# EAGLE schematic board 1 (EAGLE 7.2.0)
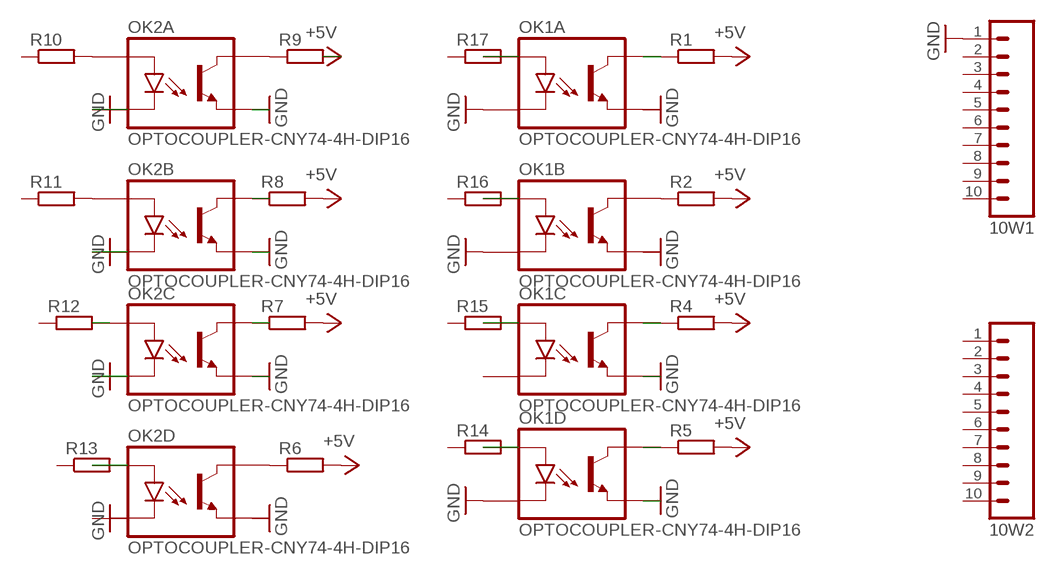
[diagram p0: schematic, sheet 1]

## Parts
10W1  M10  [10P]
10W2  M10  [10P]
OK1  OPTOCOUPLER-CNY74-4H-DIP16  [DIL16-3]
OK2  OPTOCOUPLER-CNY74-4H-DIP16  [DIL16-3]
R1  R-EU_0207/7  [0207/7]
R2  R-EU_0207/7  [0207/7]
R4  R-EU_0207/7  [0207/7]
R5  R-EU_0207/7  [0207/7]
R6  R-EU_0207/7  [0207/7]
R7  R-EU_0207/7  [0207/7]
R8  R-EU_0207/7  [0207/7]
R9  R-EU_0207/7  [0207/7]
R10  R-EU_0207/7  [0207/7]
R11  R-EU_0207/7  [0207/7]
R12  R-EU_0207/7  [0207/7]
R13  R-EU_0207/7  [0207/7]
R14  R-EU_0207/7  [0207/7]
R15  R-EU_0207/7  [0207/7]
R16  R-EU_0207/7  [0207/7]
R17  R-EU_0207/7  [0207/7]

## Nets
+5V: R1.2 R2.2 R4.2 R5.2 R6.2 R7.2 R8.2 R9.2
ALM3: OK1.4(B:A1) R16.2
ALM4: OK1.1(A:A1) R17.2
GND: 10W1.1 OK1.2(A:C1) OK1.3(B:C1) OK1.7(D:C1) OK1.10(D:EMITTER1) OK1.12(C:EMITTER1) OK2.2(A:C1) OK2.3(B:C1) OK2.6(C:C1) OK2.12(C:EMITTER1) OK2.13(B:EMITTER1) OK2.16(A:EMITTER1)
N$1: OK1.15(A:COLLECTOR1) R1.1
N$2: OK2.14(B:COLLECTOR1) R8.1
N$4: OK1.11(C:COLLECTOR1) R4.1
N$5: OK1.9(D:COLLECTOR1) R5.1
N$6: OK2.9(D:COLLECTOR1) R6.1
N$7: OK2.4(B:A1) R11.2
N$8: OK2.5(C:A1) R12.2
N$9: OK2.8(D:A1) R13.2
N$10: OK1.8(D:A1) R14.2
N$11: OK1.5(C:A1) R15.2
N$13: OK1.14(B:COLLECTOR1) R2.1
N$15: OK2.1(A:A1) R10.2
N$16: OK2.15(A:COLLECTOR1) R9.1
N$17: OK2.11(C:COLLECTOR1) R7.1
Unconnected: 10W1.2 10W1.3 10W1.4 10W1.5 10W1.6 10W1.7 10W1.8 10W1.9 10W1.10 10W2.1 10W2.2 10W2.3 10W2.4 10W2.5 10W2.6 10W2.7 10W2.8 10W2.9 10W2.10 OK1.6(C:C1) OK1.13(B:EMITTER1) OK1.16(A:EMITTER1) OK2.7(D:C1) OK2.10(D:EMITTER1) R10.1 R11.1 R12.1 R13.1 R14.1 R15.1 R16.1 R17.1

## Library data of the parts
10W1 10W2 = con-amp-quick:M10: AMP QUICK CONNECTOR; OC_FARNELL: unknown; OC_NEWARK: unknown
OK1 OK2 = tidyeagle:OPTOCOUPLER-CNY74-4H: 4-Channel Phototransistor Optocoupler Transistor Optocoupler Datasheet: Full <http://www.vishay.com/docs/83526/83526.pdf> Not Tested.
R1 R2 R4-R17 = resistor:R-EU_: RESISTOR, European symbol